# Altium schematic sheet S7CAS-PLEIADES-CARTE-MERE_P07_FPGA_2.SchDoc
size Tabloid; DocumentNumber: 6; SheetNumber: 6; SheetTotal: 16; Sheet_Name: FPGA_2; Size: 11x17
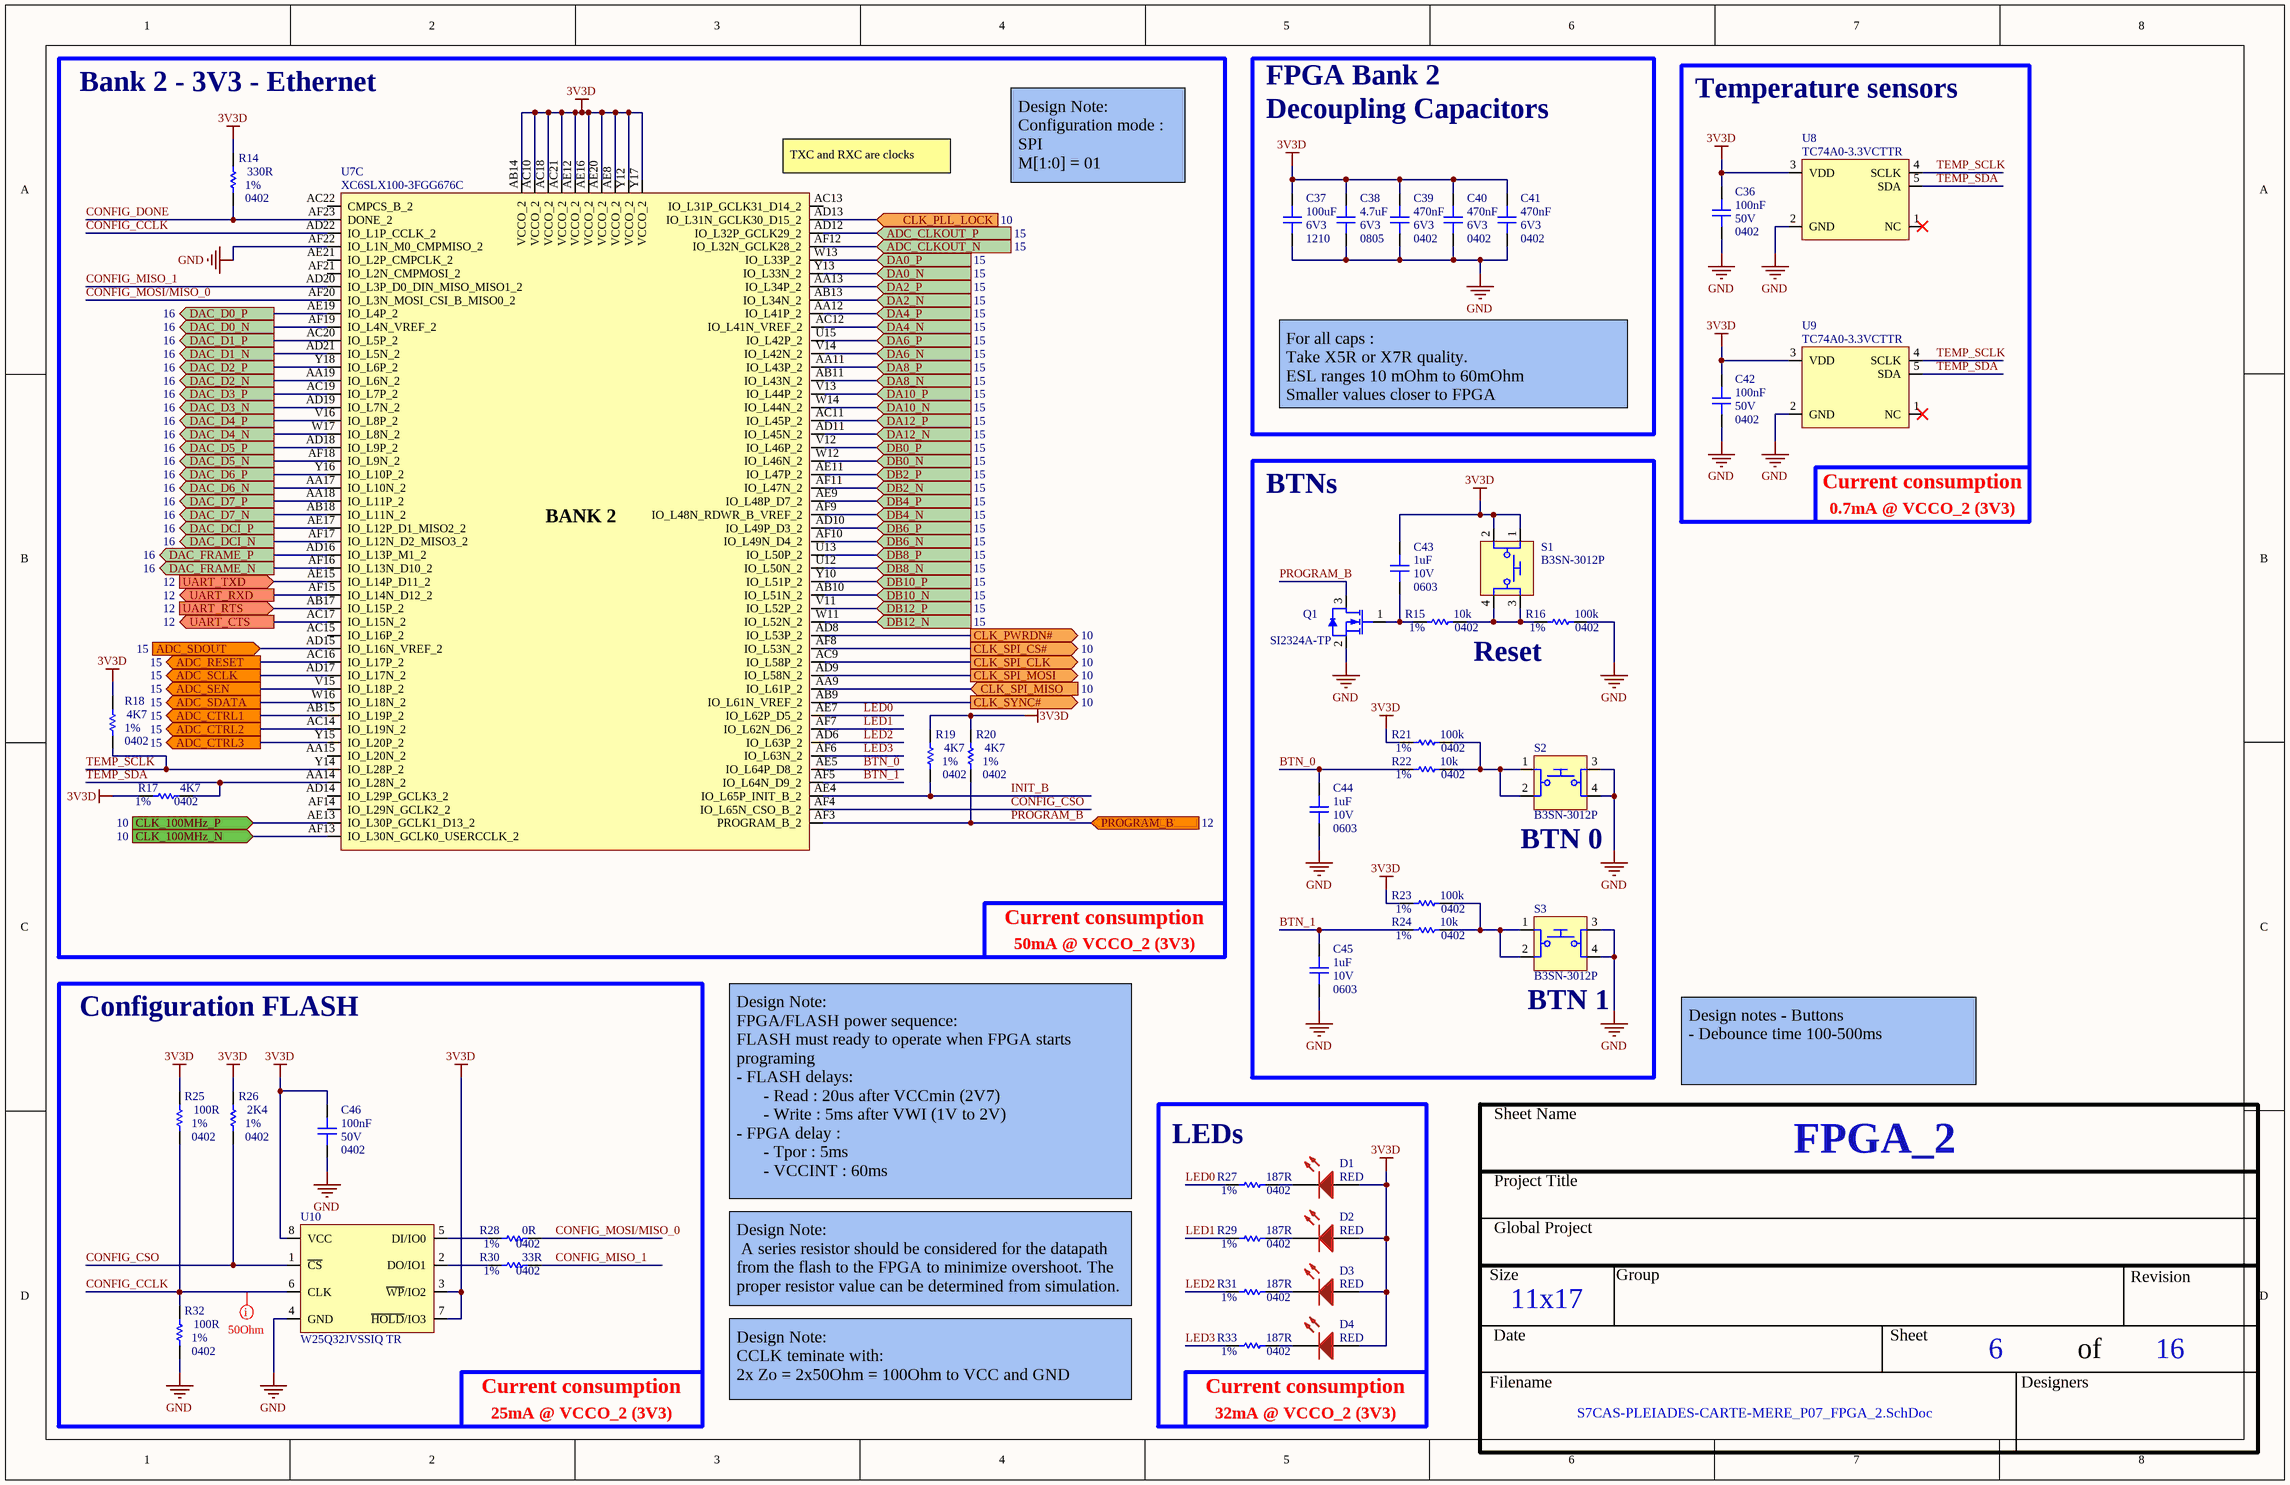
[diagram p0: S7CAS-PLEIADES-CARTE-MERE_P07_FPGA_2.SchDoc]

## Parts
C36  value 100nF  Voltage: 50V  Package: 0402  [CAP_0402]  (hidden comment: CAP - 0402)
C37  value 100uF  Voltage: 6V3  Package: 1210  [CAP_1210]  (hidden comment: CAP - 1210)
C38  value 4.7uF  Voltage: 6V3  Package: 0805  [CAP_0805]  (hidden comment: CAP - 0805)
C39  value 470nF  Voltage: 6V3  Package: 0402  [CAP_0402]  (hidden comment: CAP - 0402)
C40  value 470nF  Voltage: 6V3  Package: 0402  [CAP_0402]  (hidden comment: CAP - 0402)
C41  value 470nF  Voltage: 6V3  Package: 0402  [CAP_0402]  (hidden comment: CAP - 0402)
C42  value 100nF  Voltage: 50V  Package: 0402  [CAP_0402]  (hidden comment: CAP - 0402)
C43  value 1uF  Voltage: 10V  Package: 0603  [CAP_0603]  (hidden comment: CAP - 0603)
C44  value 1uF  Voltage: 10V  Package: 0603  [CAP_0603]  (hidden comment: CAP - 0603)
C45  value 1uF  Voltage: 10V  Package: 0603  [CAP_0603]  (hidden comment: CAP - 0603)
C46  value 100nF  Voltage: 50V  Package: 0402  [CAP_0402]  (hidden comment: CAP - 0402)
D1  value RED  [LED_0603]  (hidden comment: SML-311UTT86)
D2  value RED  [LED_0603]  (hidden comment: SML-311UTT86)
D3  value RED  [LED_0603]  (hidden comment: SML-311UTT86)
D4  value RED  [LED_0603]  (hidden comment: SML-311UTT86)
Q1  SI2324A-TP  [TRX_NMOS_SI324A-TP]
R14  value 330R  Package: 0402  Precision: 1%  [RES_0402]  (hidden comment: RES - 0402)
R15  value 10k  Package: 0402  Precision: 1%  [RES_0402]  (hidden comment: RES - 0402)
R16  value 100k  Package: 0402  Precision: 1%  [RES_0402]  (hidden comment: RES - 0402)
R17  value 4K7  Package: 0402  Precision: 1%  [RES_0402]  (hidden comment: RES - 0402)
R18  value 4K7  Package: 0402  Precision: 1%  [RES_0402]  (hidden comment: RES - 0402)
R19  value 4K7  Package: 0402  Precision: 1%  [RES_0402]  (hidden comment: RES - 0402)
R20  value 4K7  Package: 0402  Precision: 1%  [RES_0402]  (hidden comment: RES - 0402)
R21  value 100k  Package: 0402  Precision: 1%  [RES_0402]  (hidden comment: RES - 0402)
R22  value 10k  Package: 0402  Precision: 1%  [RES_0402]  (hidden comment: RES - 0402)
R23  value 100k  Package: 0402  Precision: 1%  [RES_0402]  (hidden comment: RES - 0402)
R24  value 10k  Package: 0402  Precision: 1%  [RES_0402]  (hidden comment: RES - 0402)
R25  value 100R  Package: 0402  Precision: 1%  [RES_0402]  (hidden comment: RES - 0402)
R26  value 2K4  Package: 0402  Precision: 1%  [RES_0402]  (hidden comment: RES - 0402)
R27  value 187R  Package: 0402  Precision: 1%  [RES_0402]  (hidden comment: RES - 0402)
R28  value 0R  Package: 0402  Precision: 1%  [RES_0402]  (hidden comment: RES - 0402)
R29  value 187R  Package: 0402  Precision: 1%  [RES_0402]  (hidden comment: RES - 0402)
R30  value 33R  Package: 0402  Precision: 1%  [RES_0402]  (hidden comment: RES - 0402)
R31  value 187R  Package: 0402  Precision: 1%  [RES_0402]  (hidden comment: RES - 0402)
R32  value 100R  Package: 0402  Precision: 1%  [RES_0402]  (hidden comment: RES - 0402)
R33  value 187R  Package: 0402  Precision: 1%  [RES_0402]  (hidden comment: RES - 0402)
S1  B3SN-3012P  [SWI_TACT_B3SN-3012P]
S2  B3SN-3012P  [SWI_TACT_B3SN-3012P]
S3  B3SN-3012P  [SWI_TACT_B3SN-3012P]
U7  XC6SLX100-3FGG676C  [FPGA_XILINX_FGG676]  (part C of 10)
U8  TC74A0-3.3VCTTR  [SEN_TEMP_TC74A0-3.3VCTTR]
U9  TC74A0-3.3VCTTR  [SEN_TEMP_TC74A0-3.3VCTTR]
U10  W25Q32JVSSIQ TR  [MEM_FLASH_W25Q32JVSSIQ TR]

## Blocks framed on the sheet
Bank 2 - 3V3 - Ethernet: R14 R17-R20 U7
Temperature sensors: C36 C42 U8 U9
Configuration FLASH: C46 R25 R26 R28 R30 R32 U10
LEDs: D1-D4 R27 R29 R31 R33

## Ports
ADC_CLKOUT_N (in, see 15), ADC_CLKOUT_P (in, see 15), ADC_CTRL1 (out, see 15), ADC_CTRL2 (out, see 15), ADC_CTRL3 (out, see 15), ADC_RESET (out, see 15), ADC_SCLK (out, see 15), ADC_SDATA (out, see 15), ADC_SDOUT (in, see 15), ADC_SEN (out, see 15), CLK_100MHz_N (in, see 10), CLK_100MHz_P (in, see 10), CLK_PLL_LOCK (in, see 10), CLK_PWRDN# (out, see 10), CLK_SPI_CLK (out, see 10), CLK_SPI_CS# (out, see 10), CLK_SPI_MISO (in, see 10), CLK_SPI_MOSI (out, see 10), CLK_SYNC# (out, see 10), DA0_N (in, see 15), DA0_P (in, see 15), DA2_N (in, see 15), DA2_P (in, see 15), DA4_N (in, see 15), DA4_P (in, see 15), DA6_N (in, see 15), DA6_P (in, see 15), DA8_N (in, see 15), DA8_P (in, see 15), DA10_N (in, see 15), DA10_P (in, see 15), DA12_N (in, see 15), DA12_P (in, see 15), DAC_D0_N (out, see 16), DAC_D0_P (out, see 16), DAC_D1_N (out, see 16), DAC_D1_P (out, see 16), DAC_D2_N (out, see 16), DAC_D2_P (out, see 16), DAC_D3_N (out, see 16), DAC_D3_P (out, see 16), DAC_D4_N (out, see 16), DAC_D4_P (out, see 16), DAC_D5_N (out, see 16), DAC_D5_P (out, see 16), DAC_D6_N (out, see 16), DAC_D6_P (out, see 16), DAC_D7_N (out, see 16), DAC_D7_P (out, see 16), DAC_DCI_N (out, see 16), DAC_DCI_P (out, see 16), DAC_FRAME_N (out, see 16), DAC_FRAME_P (out, see 16), DB0_N (in, see 15), DB0_P (in, see 15), DB2_N (in, see 15), DB2_P (in, see 15), DB4_N (in, see 15), DB4_P (in, see 15), DB6_N (in, see 15), DB6_P (in, see 15), DB8_N (in, see 15), DB8_P (in, see 15), DB10_N (in, see 15), DB10_P (in, see 15), DB12_N (in, see 15), DB12_P (in, see 15), PROGRAM_B (in, see 12), UART_CTS (out, see 12), UART_RTS (in, see 12), UART_RXD (out, see 12), UART_TXD (in, see 12)

## Nets
3V3D: C36.2 C37.2 C38.2 C39.2 C40.2 C41.2 C42.2 C43.2 C46.2 D1.A D2.A D3.A D4.A R14.2 R17.1 R18.2 R19.2 R20.2 R21.1 R23.1 R25.2 R26.2 S1.1 S1.2 U7.AB14(VCCO_2) U7.AC10(VCCO_2) U7.AC18(VCCO_2) U7.AC21(VCCO_2) U7.AE8(VCCO_2) U7.AE12(VCCO_2) U7.AE16(VCCO_2) U7.AE20(VCCO_2) U7.Y12(VCCO_2) U7.Y17(VCCO_2) U8.3(VDD) U9.3(VDD) U10.3(~{WP}/IO2) U10.7(~{HOLD}/IO3) U10.8(VCC)
GND: C36.1 C37.1 C38.1 C39.1 C40.1 C41.1 C42.1 C44.1 C45.1 C46.1 Q1.2(S) R16.2 R32.1 S2.3 S2.4 S3.3 S3.4 U7.AF22(IO_L1N_M0_CMPMISO_2) U8.2(GND) U9.2(GND) U10.4(GND)
ADC_CLKOUT_N: U7.AF12(IO_L32N_GCLK28_2) ; port ADC_CLKOUT_N
ADC_CLKOUT_P: U7.AD12(IO_L32P_GCLK29_2) ; port ADC_CLKOUT_P
ADC_CTRL1: U7.AB15(IO_L19P_2) ; port ADC_CTRL1
ADC_CTRL2: U7.AC14(IO_L19N_2) ; port ADC_CTRL2
ADC_CTRL3: U7.Y15(IO_L20P_2) ; port ADC_CTRL3
ADC_RESET: U7.AC16(IO_L17P_2) ; port ADC_RESET
ADC_SCLK: U7.AD17(IO_L17N_2) ; port ADC_SCLK
ADC_SDATA: U7.W16(IO_L18N_2) ; port ADC_SDATA
ADC_SDOUT: U7.AD15(IO_L16N_VREF_2) ; port ADC_SDOUT
ADC_SEN: U7.V15(IO_L18P_2) ; port ADC_SEN
BTN_0: C44.2 R22.1 U7.AE5(IO_L64P_D8_2)
BTN_1: C45.2 R24.1 U7.AF5(IO_L64N_D9_2)
CLK_100MHz_N: U7.AF13(IO_L30N_GCLK0_USERCCLK_2) ; port CLK_100MHz_N
CLK_100MHz_P: U7.AE13(IO_L30P_GCLK1_D13_2) ; port CLK_100MHz_P
CLK_PLL_LOCK: U7.AD13(IO_L31N_GCLK30_D15_2) ; port CLK_PLL_LOCK
CLK_PWRDN#: U7.AD8(IO_L53P_2) ; port CLK_PWRDN#
CLK_SPI_CLK: U7.AC9(IO_L58P_2) ; port CLK_SPI_CLK
CLK_SPI_CS#: U7.AF8(IO_L53N_2) ; port CLK_SPI_CS#
CLK_SPI_MISO: U7.AA9(IO_L61P_2) ; port CLK_SPI_MISO
CLK_SPI_MOSI: U7.AD9(IO_L58N_2) ; port CLK_SPI_MOSI
CLK_SYNC#: U7.AB9(IO_L61N_VREF_2) ; port CLK_SYNC#
CONFIG_CCLK: R25.1 R32.2 U7.AD22(IO_L1P_CCLK_2) U10.6(CLK)
CONFIG_CSO: R26.1 U7.AF4(IO_L65N_CSO_B_2) U10.1(~{CS})
CONFIG_DONE: R14.1 U7.AF23(DONE_2)
CONFIG_MISO_1: R30.1 U7.AD20(IO_L3P_D0_DIN_MISO_MISO1_2)
CONFIG_MOSI/MISO_0: R28.1 U7.AF20(IO_L3N_MOSI_CSI_B_MISO0_2)
DA0_N: U7.Y13(IO_L33N_2) ; port DA0_N
DA0_P: U7.W13(IO_L33P_2) ; port DA0_P
DA2_N: U7.AB13(IO_L34N_2) ; port DA2_N
DA2_P: U7.AA13(IO_L34P_2) ; port DA2_P
DA4_N: U7.AC12(IO_L41N_VREF_2) ; port DA4_N
DA4_P: U7.AA12(IO_L41P_2) ; port DA4_P
DA6_N: U7.V14(IO_L42N_2) ; port DA6_N
DA6_P: U7.U15(IO_L42P_2) ; port DA6_P
DA8_N: U7.AB11(IO_L43N_2) ; port DA8_N
DA8_P: U7.AA11(IO_L43P_2) ; port DA8_P
DA10_N: U7.W14(IO_L44N_2) ; port DA10_N
DA10_P: U7.V13(IO_L44P_2) ; port DA10_P
DA12_N: U7.AD11(IO_L45N_2) ; port DA12_N
DA12_P: U7.AC11(IO_L45P_2) ; port DA12_P
DAC_D0_N: U7.AF19(IO_L4N_VREF_2) ; port DAC_D0_N
DAC_D0_P: U7.AE19(IO_L4P_2) ; port DAC_D0_P
DAC_D1_N: U7.AD21(IO_L5N_2) ; port DAC_D1_N
DAC_D1_P: U7.AC20(IO_L5P_2) ; port DAC_D1_P
DAC_D2_N: U7.AA19(IO_L6N_2) ; port DAC_D2_N
DAC_D2_P: U7.Y18(IO_L6P_2) ; port DAC_D2_P
DAC_D3_N: U7.AD19(IO_L7N_2) ; port DAC_D3_N
DAC_D3_P: U7.AC19(IO_L7P_2) ; port DAC_D3_P
DAC_D4_N: U7.W17(IO_L8N_2) ; port DAC_D4_N
DAC_D4_P: U7.V16(IO_L8P_2) ; port DAC_D4_P
DAC_D5_N: U7.AF18(IO_L9N_2) ; port DAC_D5_N
DAC_D5_P: U7.AD18(IO_L9P_2) ; port DAC_D5_P
DAC_D6_N: U7.AA17(IO_L10N_2) ; port DAC_D6_N
DAC_D6_P: U7.Y16(IO_L10P_2) ; port DAC_D6_P
DAC_D7_N: U7.AB18(IO_L11N_2) ; port DAC_D7_N
DAC_D7_P: U7.AA18(IO_L11P_2) ; port DAC_D7_P
DAC_DCI_N: U7.AF17(IO_L12N_D2_MISO3_2) ; port DAC_DCI_N
DAC_DCI_P: U7.AE17(IO_L12P_D1_MISO2_2) ; port DAC_DCI_P
DAC_FRAME_N: U7.AF16(IO_L13N_D10_2) ; port DAC_FRAME_N
DAC_FRAME_P: U7.AD16(IO_L13P_M1_2) ; port DAC_FRAME_P
DB0_N: U7.W12(IO_L46N_2) ; port DB0_N
DB0_P: U7.V12(IO_L46P_2) ; port DB0_P
DB2_N: U7.AF11(IO_L47N_2) ; port DB2_N
DB2_P: U7.AE11(IO_L47P_2) ; port DB2_P
DB4_N: U7.AF9(IO_L48N_RDWR_B_VREF_2) ; port DB4_N
DB4_P: U7.AE9(IO_L48P_D7_2) ; port DB4_P
DB6_N: U7.AF10(IO_L49N_D4_2) ; port DB6_N
DB6_P: U7.AD10(IO_L49P_D3_2) ; port DB6_P
DB8_N: U7.U12(IO_L50N_2) ; port DB8_N
DB8_P: U7.U13(IO_L50P_2) ; port DB8_P
DB10_N: U7.AB10(IO_L51N_2) ; port DB10_N
DB10_P: U7.Y10(IO_L51P_2) ; port DB10_P
DB12_N: U7.W11(IO_L52N_2) ; port DB12_N
DB12_P: U7.V11(IO_L52P_2) ; port DB12_P
INIT_B: R19.1 U7.AE4(IO_L65P_INIT_B_2)
LED0: R27.1 U7.AE7(IO_L62P_D5_2)
LED1: R29.1 U7.AF7(IO_L62N_D6_2)
LED2: R31.1 U7.AD6(IO_L63P_2)
LED3: R33.1 U7.AF6(IO_L63N_2)
PROGRAM_B: Q1.3(D) R20.1 U7.AF3(PROGRAM_B_2) ; port PROGRAM_B
TEMP_SCLK: R18.1 U7.Y14(IO_L28P_2) U8.4(SCLK) U9.4(SCLK)
TEMP_SDA: R17.2 U7.AA14(IO_L28N_2) U8.5(SDA) U9.5(SDA)
UART_CTS: U7.AC17(IO_L15N_2) ; port UART_CTS
UART_RTS: U7.AB17(IO_L15P_2) ; port UART_RTS
UART_RXD: U7.AF15(IO_L14N_D12_2) ; port UART_RXD
UART_TXD: U7.AE15(IO_L14P_D11_2) ; port UART_TXD
NetC43_1: C43.1 Q1.1(G) R15.1
NetD1_K: D1.K R27.2
NetD2_K: D2.K R29.2
NetD3_K: D3.K R31.2
NetD4_K: D4.K R33.2
NetR15_2: R15.2 R16.1 S1.3 S1.4
NetR21_2: R21.2 R22.2 S2.1 S2.2
NetR23_2: R23.2 R24.2 S3.1 S3.2
NetR28_2: R28.2 U10.5(DI/IO0)
NetR30_2: R30.2 U10.2(DO/IO1)

Not connected (* = marked no-connect by the designer): U7 AA15(IO_L20N_2) AC13(IO_L31P_GCLK31_D14_2) AC15(IO_L16P_2) AC22(CMPCS_B_2) AD14(IO_L29P_GCLK3_2) AE21(IO_L2P_CMPCLK_2) AF14(IO_L29N_GCLK2_2) AF21(IO_L2N_CMPMOSI_2); U8 1(NC)*; U9 1(NC)*

## Layout directives
net class SE_50Ohm: CONFIG_CCLK

## Notes on the sheet
- FPGA Bank 2
- (near U7) TXC and RXC are clocks
- Decoupling Capacitors
- Design Note:
  Configuration mode : SPI
  M[1:0] = 01
- For all caps :
  Take X5R or X7R quality.
  ESL ranges 10 mOhm to 60mOhm
  Smaller values closer to FPGA
- BTNs
- Current consumption
- 0.7mA @ VCCO_2 (3V3)
- Reset
- (near S2) BTN 0
- 50mA @ VCCO_2 (3V3)
- (near S3) BTN 1
- Design notes - Buttons
  - Debounce time 100-500ms
- Design Note:
  FPGA/FLASH power sequence:
  FLASH must ready to operate when FPGA starts programing
  - FLASH delays:
  - Read : 20us after VCCmin (2V7)
  - Write : 5ms after VWI (1V to 2V)
  - FPGA delay :
  - Tpor : 5ms
  - VCCINT : 60ms
- Design Note:
  A series resistor should be considered for the datapath from the flash to the FPGA to minimize overshoot. The proper resistor value can be determined from simulation.
- 25mA @ VCCO_2 (3V3)
- Design Note:
  CCLK teminate with:
  2x Zo = 2x50Ohm = 100Ohm to VCC and GND
- 32mA @ VCCO_2 (3V3)
- Sheet Name
- Project Title
- Global Project
- Size
- Group
- Revision
- Date
- Sheet
- of
- Filename
- Designers
- (in symbol FPGA_XC6SLX100-3FGG676C, part C) BANK 2

## Library data of the parts
C36 C39-C42 C46 = CAP - 0402: Precision: 10%; Current: *; CreatedBy: Jonathan Bouchard; Power: *
C37 = CAP - 1210: Precision: 10%; Current: *; CreatedBy: Jonathan Bouchard; Power: *
C38 = CAP - 0805: Precision: 10%; Current: *; CreatedBy: Jonathan Bouchard; Power: *
C43-C45 = CAP - 0603: Precision: 10%; Current: *; CreatedBy: Jonathan Bouchard; Power: *
D1-D4 = LED_SML-311UTT86: LED - 620nM RED 2mA - 0603; Voltage: 1.8V; Mfg: ROHM Semiconductor; Power: 44mW; Current: 2mA; HelpURL: http://media.digikey.com/pdf/Data%20Sheets/Rohm%20PDFs/SML-311%20Series.pdf; CreatedBy: Jonathan Bouchard; Temperature: -30°C to 85°C; Package: 0603; Precision: *; Mfg Part Number: SML-311UTT86; Supplier 1: Digikey; Supplier Part Number 1: 511-1304-1-ND
Q1 = TRX_NMOS_SI2324A-TP: TRX - MOSFET N-CH 100V 2A - SOT-23; Manufacturer #1: Micro Commercial Co; Power Max: 350mW; Voltage rating: 100V (Vds max), 2V (Vgs @ 250uA); Polarized: Yes; Magnetic Material: UNKNOWN; Current Rating: 2A; Manufacturer #2: *; Value: *; Part Number #1: SI2324A-TP; Part Number #2: *; HelpURL: https://www.mccsemi.com/pdf/Products/SI2324A(SOT-23)-A.pdf; Supplier 1: Digi-Key; Supplier Part Number 1: SI2324A-TPMSCT-ND; Assembly Type: SMD; Temperature: -55°C ~ 150°C (TJ); Package: SOT-23; CreatedBy/Date: *; GRAMS Lib Spec: *; Tolerance: *; VerifiedBy: *; Cryo: *
R14-R33 = RES - 0402: Voltage: 50V; Power: 1/16W; Current: *; CreatedBy: Jonathan Bouchard
S1-S3 = SWI_TACT_B3SN-3012P_1: SWI - SWITCH TACTILE SPST-NO 0.05A 24V -SMD; Manufacturer #1: Omron Electronics Inc-EMC Div; Current Rating: 50mA; Voltage rating: 24VDC; Polarized: No; Magnetic Material: UNKNOWN; GRAMS Lib Spec: 2.8; Manufacturer #2: *; Power Max: *; Value: SPST-NO; Part Number #1: B3SN-3012P; Part Number #2: *; HelpURL: http://omronfs.omron.com/en_US/ecb/products/pdf/en-b3sn.pdf; Supplier 1: Digi-Key; Supplier Part Number 1: SW261CT-ND; Assembly Type: SMD; Temperature: -25°C ~ 70°C; Package: SMD; CreatedBy/Date: Olivier Bernard / 5/12/2017; Tolerance: *; VerifiedBy: Caroline Paulin / 11 juillet 2018; Cryo: UNKNOWN
U7 = FPGA_XC6SLX100-3FGG676C: FPGA - XILINX SPARTAN 6 480 I/O - BGA-676; Voltage: 1.14 V ~ 1.26 V; Current: *; Power: *; Mfg: Xilinx; Mfg Part Number: XC6SLX100-3FGG676C; HelpURL: https://www.xilinx.com/support/documentation/data_sheets/ds162.pdf; CreatedBy: Jonathan Bouchard; Temperature: 0°C ~ 85°C (TJ); Value: *; Precision: *; Package: BGA-676; Supplier 1: Digikey; Supplier Part Number 1: 122-1760-ND
U8 U9 = SENS_TEMP_TC74A0-3.3VCTTR: SENS - TEMPERATURE SENSOR I2C/SMBUS - SOT23-5; Voltage: 2.7 V ~ 5.5 V; Mfg: Microchip; Precision: ±2°C (±3°C); Current: *; Power: *; Mfg Part Number: TC74A0-3.3VCTTR; HelpURL: http://ww1.microchip.com/downloads/en/DeviceDoc/21462D.pdf; CreatedBy: Jonathan Bouchard; Temperature: -40°C ~ 125°C; Value: *; Package: SOT23-5; Supplier 1: Digikey; Supplier Part Number 1: TC74A0-3.3VCTDKR-ND
U10 = MEM_FLASH_W25Q32JVSSIQ TR: MEM - FLASH NOR 32Mb 133MHZ - 8-SOIC; Voltage: 2.7 V ~ 3.6 V; Mfg: Winbond Electronics; Current: *; Power: *; Mfg Part Number: W25Q32JVSSIQ TR; HelpURL: https://www.winbond.com/resource-files/w25q32jv%20revg%2003272018%20plus.pdf; CreatedBy: Louis-Daniel Gaulin; Temperature: -40°C ~ 85°C (TA); Value: *; Precision: *; Package: 8-SOIC; Supplier Part Number 1: W25Q32JVSSIQCT-ND; Supplier 1: Digikey